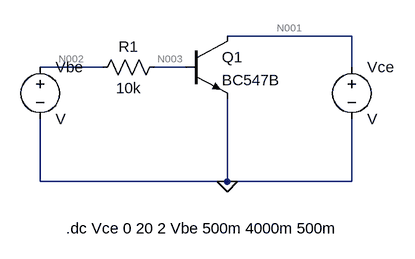
[diagram p0: schematic BJT.asc]
BJT.asc, the LTspice schematic file:
Version 4
SHEET 1 880 680
WIRE 272 80 80 80
WIRE -112 128 -208 128
WIRE 16 128 -32 128
WIRE 272 128 272 80
WIRE -208 304 -208 208
WIRE 80 304 80 176
WIRE 80 304 -208 304
WIRE 272 304 272 208
WIRE 272 304 80 304
FLAG 80 304 0
SYMBOL npn 16 80 R0
SYMATTR InstName Q1
SYMATTR Value BC547B
SYMBOL voltage -208 112 R0
SYMATTR InstName Vbe
SYMBOL voltage 272 112 R0
SYMATTR InstName Vce
SYMBOL res -16 112 R90
WINDOW 0 0 56 VBottom 2
WINDOW 3 32 56 VTop 2
SYMATTR InstName R1
SYMATTR Value 10k
TEXT -168 376 Left 2 !.dc Vce 0 20 2 Vbe 500m 4000m 500m

The netlist it stands for:
* BJT.asc
Q1 N001 N003 0 0 BC547B
Vbe N002 0 V
Vce N001 0 V
R1 N003 N002 10k
.model NPN NPN
.model PNP PNP
.lib standard.bjt
.dc Vce 0 20 2 Vbe 500m 4000m 500m
.backanno
.end

* Results of the author's LTspice run, read from the files saved beside the schematic
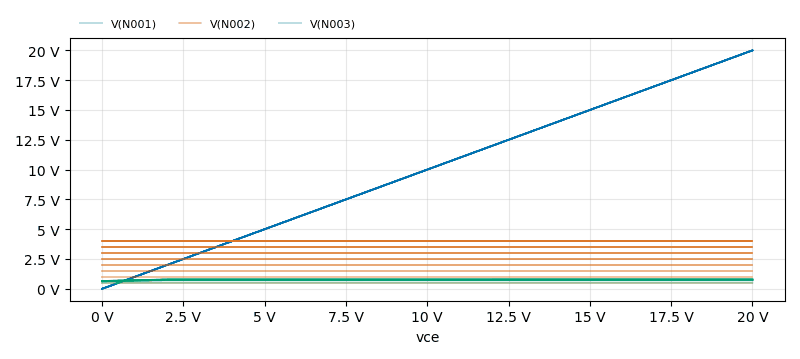
[diagram p1: DC transfer characteristic of BJT.asc, plotted from the saved traces]
* DC transfer characteristic, 8 runs:
*   V(N001) [run 1]: 0 V at vce=0 V, 20 V at vce=20 V, min 0 V, max 20 V
*   V(N001) [run 2]: 0 V at vce=0 V, 20 V at vce=20 V, min 0 V, max 20 V
*   V(N001) [run 3]: 0 V at vce=0 V, 20 V at vce=20 V, min 0 V, max 20 V
*   V(N001) [run 4]: 0 V at vce=0 V, 20 V at vce=20 V, min 0 V, max 20 V
*   V(N001) [run 5]: 0 V at vce=0 V, 20 V at vce=20 V, min 0 V, max 20 V
*   V(N001) [run 6]: 0 V at vce=0 V, 20 V at vce=20 V, min 0 V, max 20 V
*   V(N001) [run 7]: 0 V at vce=0 V, 20 V at vce=20 V, min 0 V, max 20 V
*   V(N001) [run 8]: 0 V at vce=0 V, 20 V at vce=20 V, min 0 V, max 20 V
*   V(N002) [run 1]: 500 mV at vce=0 V, 500 mV at vce=20 V, min 500 mV, max 500 mV
*   V(N002) [run 2]: 1 V at vce=0 V, 1 V at vce=20 V, min 1 V, max 1 V
*   V(N002) [run 3]: 1.5 V at vce=0 V, 1.5 V at vce=20 V, min 1.5 V, max 1.5 V
*   V(N002) [run 4]: 2 V at vce=0 V, 2 V at vce=20 V, min 2 V, max 2 V
*   V(N002) [run 5]: 2.5 V at vce=0 V, 2.5 V at vce=20 V, min 2.5 V, max 2.5 V
*   V(N002) [run 6]: 3 V at vce=0 V, 3 V at vce=20 V, min 3 V, max 3 V
*   V(N002) [run 7]: 3.5 V at vce=0 V, 3.5 V at vce=20 V, min 3.5 V, max 3.5 V
*   V(N002) [run 8]: 4 V at vce=0 V, 4 V at vce=20 V, min 4 V, max 4 V
*   V(N003) [run 1]: 492 mV at vce=0 V, 499.8 mV at vce=20 V, min 492 mV, max 499.8 mV
*   V(N003) [run 2]: 599.2 mV at vce=0 V, 699.4 mV at vce=20 V, min 599.2 mV, max 699.4 mV
*   V(N003) [run 3]: 620.5 mV at vce=0 V, 730.8 mV at vce=20 V, min 620.5 mV, max 730.8 mV
*   V(N003) [run 4]: 632.5 mV at vce=0 V, 749.7 mV at vce=20 V, min 632.5 mV, max 749.7 mV
*   V(N003) [run 5]: 640.8 mV at vce=0 V, 764 mV at vce=20 V, min 640.8 mV, max 764 mV
*   V(N003) [run 6]: 647.2 mV at vce=0 V, 775.7 mV at vce=20 V, min 647.2 mV, max 775.7 mV
*   V(N003) [run 7]: 652.4 mV at vce=0 V, 785.8 mV at vce=20 V, min 652.4 mV, max 785.8 mV
*   V(N003) [run 8]: 656.8 mV at vce=0 V, 794.8 mV at vce=20 V, min 656.8 mV, max 794.8 mV